# EAGLE design 150244-1-legoled-v1.1 (EAGLE 7.2.0)
AUTHOR: CPV; COPYRIGHT: (c) Elektor; NRS: 150244; REV: 1.1
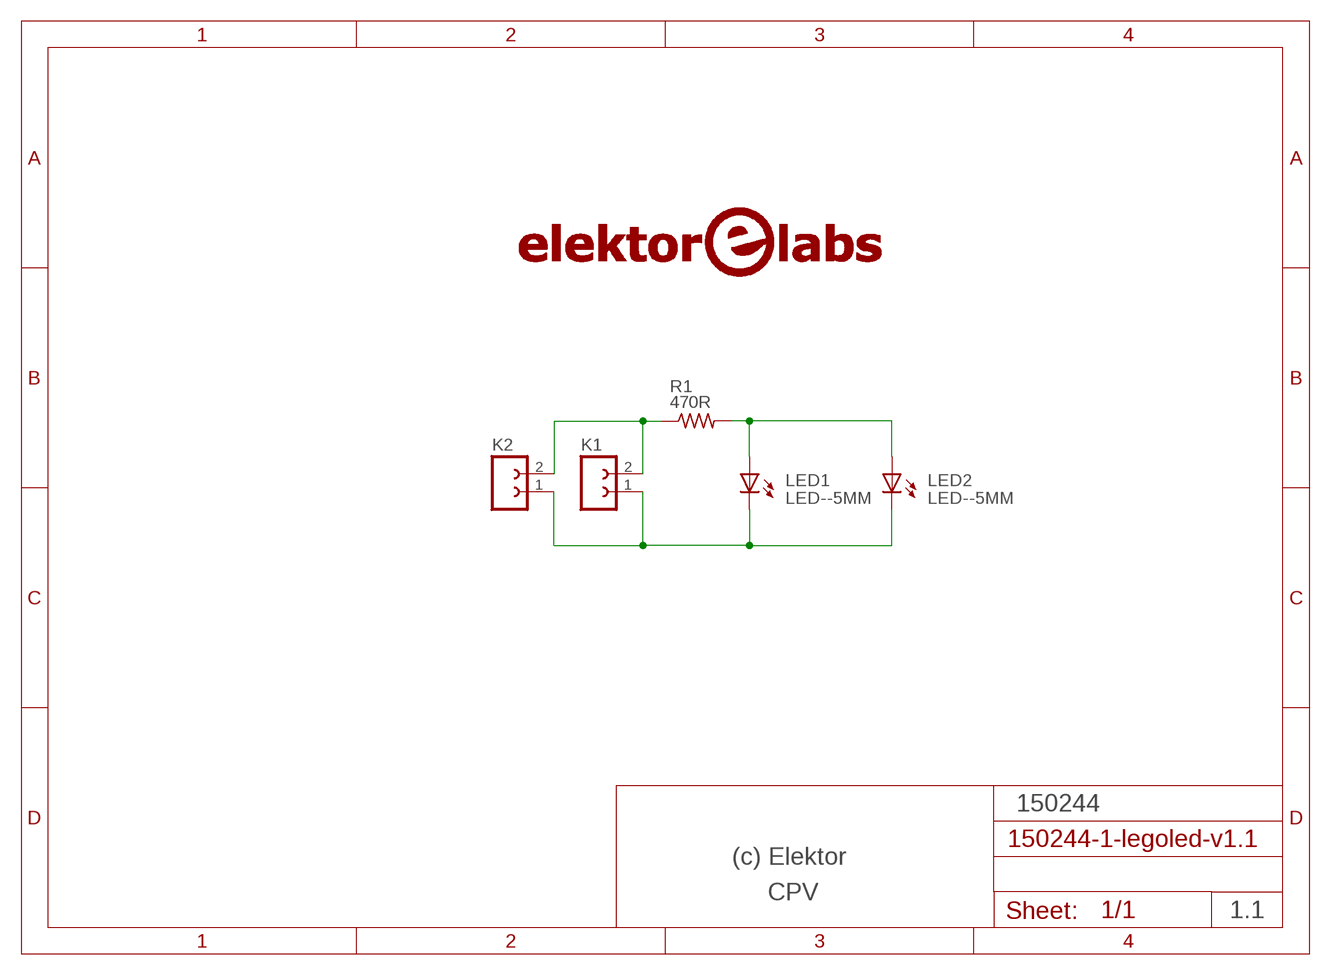
[diagram p0: schematic, sheet 1]

## Parts
K1  K-HEADER-FEMALE-1X2-H  [EPP-SIL-F-2-WAY-90DEG]
K2  K-HEADER-FEMALE-1X2-H  [EPP-SIL-F-2-WAY-90DEG]
LED1  LED--5MM  [EPP-LED-5MM]
LED2  LED--5MM  [EPP-LED-5MM]
LOGO1  LOGO-ELEKTOR-LABS-18MM-V2  [EPP-LOGO-ELEKTOR-LABS-V2-18MM]
R1  470R  R-US_R0805  [R0805]

## Nets
N$1: K1.2 K2.2 R1.1
N$2: LED1.A LED2.A R1.2
N$3: K1.1 K2.1 LED1.C LED2.C

## Library data of the parts
K1 K2 = 150244-1-legoled-v1.1:K-HEADER-FEMALE-1X2-: FEMALE HEADER; FARNELL: 9728880; RS: unknown
LED1 LED2 = 150244 Lego LED:LED-*-: LED
LOGO1 = 150244 Lego LED:LOGO-ELEKTOR-LABS: Logo, Elektor.Labs
R1 = 150244 Lego LED:R-US_: RESISTOR, American symbol

## Board
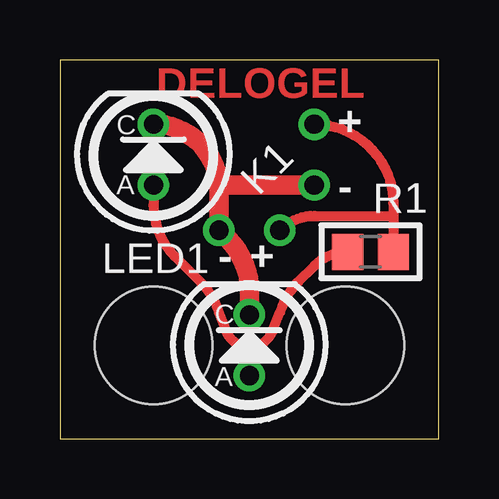
[diagram p1: board, top side]
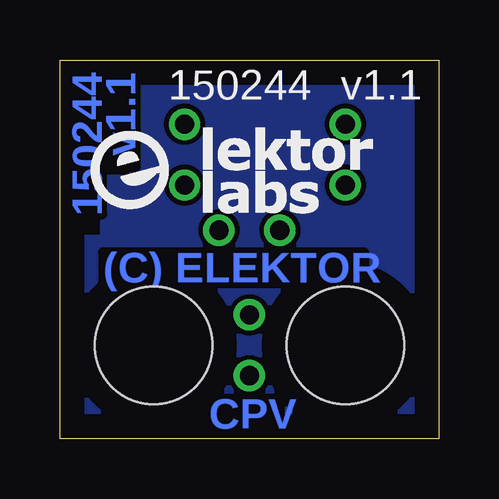
[diagram p2: board, bottom side, seen from below]

Size 15.8 x 15.8 mm. Coordinates in mm from the lower left corner, seen from the top.
Outline: 0,0 15.8,0 15.8,15.8 0,15.8 0,0
Copper layers (1*16): Top 0.035mm / dielectric 1.5mm / Bottom 0.035mm
Design rules "default": minimum track width 10mil, minimum drill 24mil, track to track 8mil, track to pad 8mil, pad to pad 8mil, via to via 8mil, smd to smd 8mil, copper to edge 40mil, drill to drill 8mil, minimum pad ring 10mil, minimum via ring 8mil, stop-mask expansion 4mil, vias tented up to drill 0mil, thermal gap 10mil
Holes 4.9 mm at 3.9,3.9 11.9,3.9

### Footprints (pad centres in the part's own frame; a part is rotated, then mirrored left to right if it is on the bottom)
EPP-SIL-F-2-WAY-90DEG = drill 0.8: 1 -1.27,0; 2 1.27,0
EPP-LED-5MM = drill 0.8: A -1.27,0; C 1.27,0
R0805 = smd 1.3 x 1.5: 1 -0.95,0; 2 0.95,0

### Placement (x,y rotation side)
K1  10.6,11.85 90 top
K2  7.9,8.7 0 top
LED1  7.9,3.9 90 top
LED2  3.9,11.85 90 top
LOGO1  12.25,11.25 0 bottom
R1  12.95,7.8 180 top

### Tracks (layer width: path | path; a pad name or v marks a point on that pad's centre or on a via)
N$1
  Top 0.406: K1.2 arc-90 13.9,9.82 13.9,9.3 | 13.9,9.3 R1.1 | K2.2 arc-45 10.62,9.3 13.9,9.3
N$2
  Top 0.406: LED2.A 3.9,9.74 arc45 4.78,7.62 5.87,6.53 arc-28 6.62,5.28 6.91,4.57 arc28 7.16,4.15 7.21,4.09 arc45 7.92,3.8 | R1.2 arc45 10.63,7.23 9.93,6.53 arc28 9.18,5.28 8.89,4.57 arc-28 8.64,4.15 8.56,4.06 arc-45 7.92,3.8 | LED1.A arc45 7.92,2.68 7.92,3.8
N$3
  Top 0.813: LED1.C 7.9,6.19 arc45 7.02,8.31 K2.1 6.63,10.4 | K1.1 6.7,10.58 6.63,10.51 6.63,10.4 | LED2.C LED2.C arc-90 6.63,10.4
N$4
  pour Bottom: 0,0 15.9,0 15.8,8.4 14,8.4 14,10.9 12.8,10.9 12.8,15.8 0,15.8

### Text on the board
Top: DELOGEL
tPlace: C | + | A | - | - | + | C | A